# EAGLE schematic Placa (EAGLE 9.3.0)
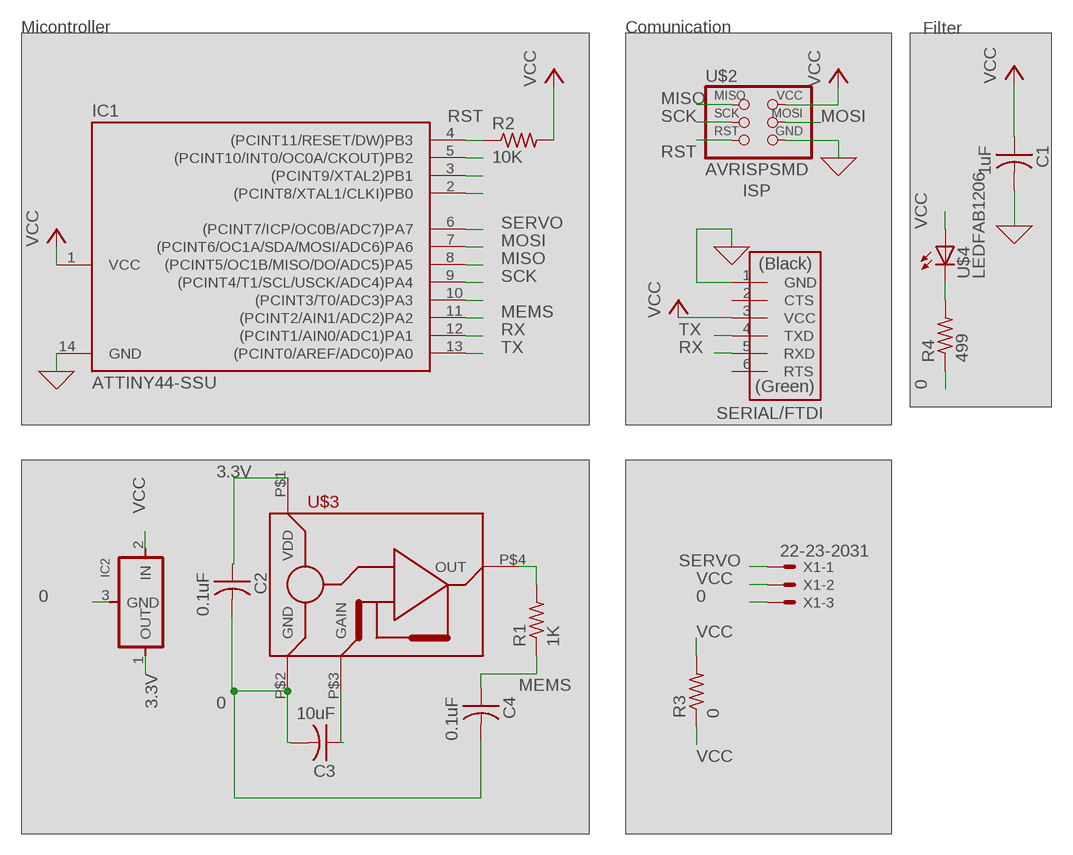
[diagram p0: schematic, sheet 1]

## Parts
C1  1uF  CAP-US1206FAB  [C1206FAB]
C2  0.1uF  CAP-US1206FAB  [C1206FAB]
C3  10uF  CAP-US1206FAB  [C1206FAB]
C4  0.1uF  CAP-US1206FAB  [C1206FAB]
IC1  ATTINY44-SSU  [SOIC14]
IC2  REGULATORSOT23  [SOT23]
R1  1K  RES-US1206FAB  [R1206FAB]
R2  10K  RES-US1206FAB  [R1206FAB]
R3  0  RES-US1206FAB  [R1206FAB]
R4  499  RES-US1206FAB  [R1206FAB]
U$1  FTDI-SMD-HEADER  [1X06SMD]
U$2  AVRISPSMD  [2X03SMD]
U$3  MEMS_MIC_SPU0414HR5H-SB  [CSP-4PIN]
U$4  LEDFAB1206  [LED1206FAB]
X1  22-23-2031  [22-23-2031]

## Nets
0: C1.2 C2.2 C3.2 C4.2 IC1.14(GND) IC2.3(GND) R4.1 U$1.1(GND) U$2.6(GND) U$3.P$2(GND) X1.3 ; supply symbol labelled GND
3.3V: C2.1 IC2.1(OUT) U$3.P$1(VDD)
MEMS: C4.1 IC1.11((PCINT2/AIN1/ADC2)PA2) R1.1
MISO: IC1.8((PCINT5/OC1B/MISO/DO/ADC5)PA5) U$2.1(MISO)
MOSI: IC1.7((PCINT6/OC1A/SDA/MOSI/ADC6)PA6) U$2.4(MOSI)
N$1: R1.2 U$3.P$4(OUT)
N$2: C3.1 U$3.P$3(GAIN)
N$4: R4.2 U$4.2(C)
N$5: IC1.5((PCINT10/INT0/OC0A/CKOUT)PB2)
N$6: IC1.3((PCINT9/XTAL2)PB1)
N$7: IC1.2((PCINT8/XTAL1/CLKI)PB0)
N$12: IC1.10((PCINT3/T0/ADC3)PA3)
RST: IC1.4((PCINT11/RESET/DW)PB3) R2.1 U$2.5(RST)
RX: IC1.12((PCINT1/AIN0/ADC1)PA1) U$1.5(RXD)
SCK: IC1.9((PCINT4/T1/SCL/USCK/ADC4)PA4) U$2.3(SCK)
SERVO: IC1.6((PCINT7/ICP/OC0B/ADC7)PA7) X1.1
TX: IC1.13((PCINT0/AREF/ADC0)PA0) U$1.4(TXD)
VCC: C1.1 IC1.1(VCC) IC2.2(IN) R2.2 R3.1 R3.2 U$1.3(VCC) U$2.2(VCC) U$4.1(A) X1.2
Unconnected: U$1.2(CTS) U$1.6(RTS)

## Notes on the sheet
- Micontroller | Comunication | Filter
- ISP
- SERIAL/FTDI

## Library data of the parts
C1-C4 = fab:CAP-US
IC1 = fab:ATTINY44
IC2 = fab:REGULATOR
R1-R4 = fab:RES-US: Resistor (US Symbol) Variants with postfix FAB are widened to allow the routing of internal traces
U$1 = fab:FTDI-SMD-HEADER
U$2 = fab:AVRISP
U$3 = fab:MEMS_MIC_SPU0414HR5H-SB
U$4 = fab:LED: LED
X1 = con-molex:22-23-2031: .100" (2.54mm) Center Header - 3 Pin; MF: MOLEX; MPN: 22-23-2031; OC_FARNELL: 1462950; OC_NEWARK: 30C0862